# EasyEDA schematic scheme_EasyEDA.json
TITLE: Protogen; REV: 0.2; Date: 2026-06-23; Sheet: 1/2; Company: e7
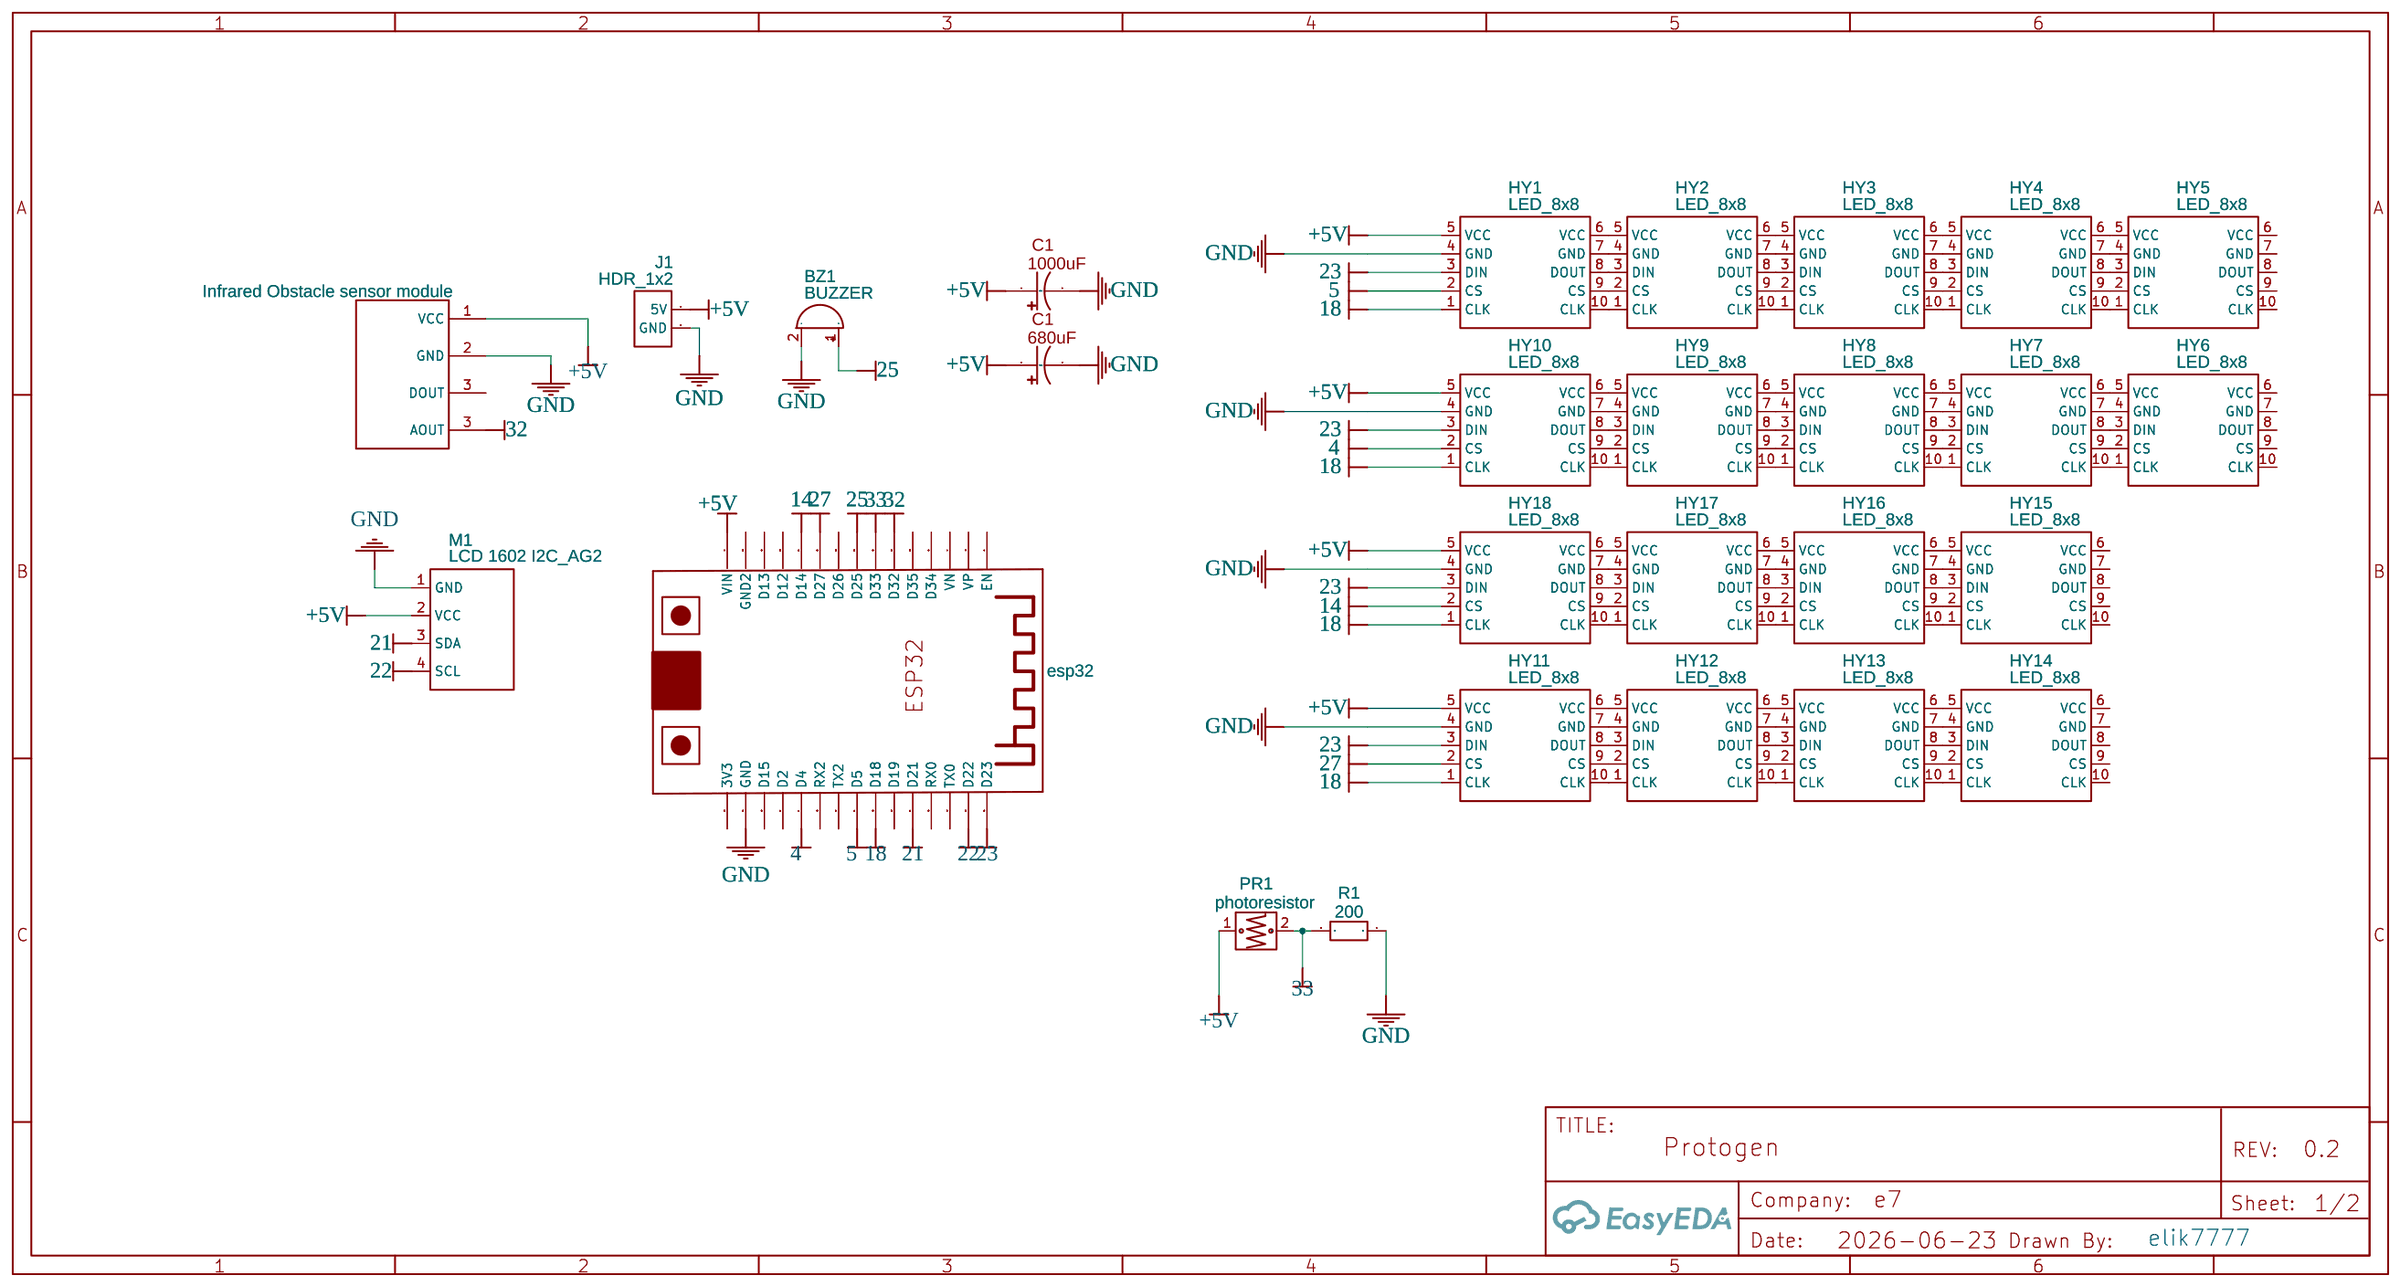
[diagram p0: schematic sheet]

## Parts
1  esp32  [ESP32-DEVKITV1_ESP32-DEVKITV1]
BZ1  BUZZER  [BUZZER_BEEPER:BUZZER_12X9.5RM7.6]
HY1  LED_8x8  [HY_MAX7219_LED_MATRIX]
HY2  LED_8x8  [HY_MAX7219_LED_MATRIX]
HY3  LED_8x8  [HY_MAX7219_LED_MATRIX]
HY4  LED_8x8  [HY_MAX7219_LED_MATRIX]
HY5  LED_8x8  [HY_MAX7219_LED_MATRIX]
HY6  LED_8x8  [HY_MAX7219_LED_MATRIX]
HY7  LED_8x8  [HY_MAX7219_LED_MATRIX]
HY8  LED_8x8  [HY_MAX7219_LED_MATRIX]
HY9  LED_8x8  [HY_MAX7219_LED_MATRIX]
HY10  LED_8x8  [HY_MAX7219_LED_MATRIX]
HY11  LED_8x8  [HY_MAX7219_LED_MATRIX]
HY12  LED_8x8  [HY_MAX7219_LED_MATRIX]
HY13  LED_8x8  [HY_MAX7219_LED_MATRIX]
HY14  LED_8x8  [HY_MAX7219_LED_MATRIX]
HY15  LED_8x8  [HY_MAX7219_LED_MATRIX]
HY16  LED_8x8  [HY_MAX7219_LED_MATRIX]
HY17  LED_8x8  [HY_MAX7219_LED_MATRIX]
HY18  LED_8x8  [HY_MAX7219_LED_MATRIX]
J1  HDR_1x2  [HDR-M-2.54_1X2]
M1  LCD 1602 I2C_AG2  [I2C LCD1602 I2C PCF8574AT]
PR1  photoresistor  [PHOTORESISTOR]
R1  200  [R_AXIAL-0.3]
U1  CAPACITOR  [CAPACITOR, 2.54MM PIN CAPACITOR]
U2  CAPACITOR  [CAPACITOR, 2.54MM PIN CAPACITOR]
U3  Infrared Obstacle sensor module  [INFRARED OBSTACLE SENSOR MODULE]

## Library data of the parts
1 = ESP32-DEVKIT-V1-30PIN: Contributor: fajarrichardo
BZ1 = DEVICE_BUZZER KU: Symbol: Device_Buzzer; Device: Device_Buzzer; Add into BOM: yes; Convert to PCB: yes; Origin Footprint: Buzzer_Beeper:Buzzer_12x9.5RM7.6; Contributor: andreaditiya72
HY1-HY18 = LED_8x8_MAX7219 cm: Manufacturer: Artillery 3C Store; Manufacturer Part: 32305941397 B; Supplier: AliExpress; Supplier Part: 32305941397; link: https://www.aliexpress.com/item/Free-shipping-MAX7219-dot-matrix-module-microcontroller-module-for-arduino-display-module-finished-goods/32305941397.html; Contributor: LieBtrau
J1 = HDR-M-2.54_1x2: Supplier Part: C124375; Supplier: LCSC; Contributor: LCEDA_Lib
M1 = LCD 1602 I2C_AG2: Contributor: pesonacorp
PR1 = photoresistor: Contributor: Christian GILSON
R1 = R_AXIAL-0.3_EU: Contributor: LCEDA_Lib
U1 U2 = CAPACITOR: Contributor: mclaude625
U3 = Infrared Obstacle sensor module: Contributor: Sebastian

## Nets
+5V: 1.VIN HY1.5(VCC) HY10.5(VCC) HY11.5(VCC) HY18.5(VCC) J1.1(5V) M1.2(VCC) PR1.1 U1.1 U2.1 U3.1(VCC)
GND: 1.GND BZ1.2(-) HY1.4(GND) HY10.4(GND) HY11.4(GND) HY18.4(GND) J1.2(GND) M1.1(GND) R1.1 U1.2 U2.2 U3.2(GND)
4: 1.D4 HY10.2(CS)
5: 1.D5 HY1.2(CS)
14: 1.D14 HY18.2(CS)
18: 1.D18 HY1.1(CLK) HY10.1(CLK) HY11.1(CLK) HY18.1(CLK)
21: 1.D21 M1.3(SDA)
22: 1.D22 M1.4(SCL)
23: 1.D23 HY1.3(DIN) HY10.3(DIN) HY11.3(DIN) HY18.3(DIN)
25: 1.D25 BZ1.1(+)
27: 1.D27 HY11.2(CS)
32: 1.D32 U3.3(AOUT)
33: 1.D33 PR1.2 R1.2
Net-(HY1-6): HY1.6(VCC) HY2.5(VCC)
Net-(HY1-7): HY1.7(GND) HY2.4(GND)
Net-(HY1-8): HY1.8(DOUT) HY2.3(DIN)
Net-(HY1-9): HY1.9(CS) HY2.2(CS)
Net-(HY1-10): HY1.10(CLK) HY2.1(CLK)
Net-(HY2-6): HY2.6(VCC) HY3.5(VCC)
Net-(HY2-7): HY2.7(GND) HY3.4(GND)
Net-(HY2-8): HY2.8(DOUT) HY3.3(DIN)
Net-(HY2-9): HY2.9(CS) HY3.2(CS)
Net-(HY2-10): HY2.10(CLK) HY3.1(CLK)
Net-(HY3-6): HY3.6(VCC) HY4.5(VCC)
Net-(HY3-7): HY3.7(GND) HY4.4(GND)
Net-(HY3-8): HY3.8(DOUT) HY4.3(DIN)
Net-(HY3-9): HY3.9(CS) HY4.2(CS)
Net-(HY3-10): HY3.10(CLK) HY4.1(CLK)
Net-(HY4-6): HY4.6(VCC) HY5.5(VCC)
Net-(HY4-7): HY4.7(GND) HY5.4(GND)
Net-(HY4-8): HY4.8(DOUT) HY5.3(DIN)
Net-(HY4-9): HY4.9(CS) HY5.2(CS)
Net-(HY4-10): HY4.10(CLK) HY5.1(CLK)
Net-(HY6-1): HY6.1(CLK) HY7.10(CLK)
Net-(HY6-2): HY6.2(CS) HY7.9(CS)
Net-(HY6-3): HY6.3(DIN) HY7.8(DOUT)
Net-(HY6-4): HY6.4(GND) HY7.7(GND)
Net-(HY6-5): HY6.5(VCC) HY7.6(VCC)
Net-(HY7-1): HY7.1(CLK) HY8.10(CLK)
Net-(HY7-2): HY7.2(CS) HY8.9(CS)
Net-(HY7-3): HY7.3(DIN) HY8.8(DOUT)
Net-(HY7-4): HY7.4(GND) HY8.7(GND)
Net-(HY7-5): HY7.5(VCC) HY8.6(VCC)
Net-(HY8-1): HY8.1(CLK) HY9.10(CLK)
Net-(HY8-2): HY8.2(CS) HY9.9(CS)
Net-(HY8-3): HY8.3(DIN) HY9.8(DOUT)
Net-(HY8-4): HY8.4(GND) HY9.7(GND)
Net-(HY8-5): HY8.5(VCC) HY9.6(VCC)
Net-(HY9-1): HY9.1(CLK) HY10.10(CLK)
Net-(HY9-2): HY9.2(CS) HY10.9(CS)
Net-(HY9-3): HY9.3(DIN) HY10.8(DOUT)
Net-(HY9-4): HY9.4(GND) HY10.7(GND)
Net-(HY9-5): HY9.5(VCC) HY10.6(VCC)
Net-(HY11-6): HY11.6(VCC) HY12.5(VCC)
Net-(HY11-7): HY11.7(GND) HY12.4(GND)
Net-(HY11-8): HY11.8(DOUT) HY12.3(DIN)
Net-(HY11-9): HY11.9(CS) HY12.2(CS)
Net-(HY11-10): HY11.10(CLK) HY12.1(CLK)
Net-(HY12-6): HY12.6(VCC) HY13.5(VCC)
Net-(HY12-7): HY12.7(GND) HY13.4(GND)
Net-(HY12-8): HY12.8(DOUT) HY13.3(DIN)
Net-(HY12-9): HY12.9(CS) HY13.2(CS)
Net-(HY12-10): HY12.10(CLK) HY13.1(CLK)
Net-(HY13-6): HY13.6(VCC) HY14.5(VCC)
Net-(HY13-7): HY13.7(GND) HY14.4(GND)
Net-(HY13-8): HY13.8(DOUT) HY14.3(DIN)
Net-(HY13-9): HY13.9(CS) HY14.2(CS)
Net-(HY13-10): HY13.10(CLK) HY14.1(CLK)
Net-(HY15-1): HY15.1(CLK) HY16.10(CLK)
Net-(HY15-2): HY15.2(CS) HY16.9(CS)
Net-(HY15-3): HY15.3(DIN) HY16.8(DOUT)
Net-(HY15-4): HY15.4(GND) HY16.7(GND)
Net-(HY15-5): HY15.5(VCC) HY16.6(VCC)
Net-(HY16-1): HY16.1(CLK) HY17.10(CLK)
Net-(HY16-2): HY16.2(CS) HY17.9(CS)
Net-(HY16-3): HY16.3(DIN) HY17.8(DOUT)
Net-(HY16-4): HY16.4(GND) HY17.7(GND)
Net-(HY16-5): HY16.5(VCC) HY17.6(VCC)
Net-(HY17-1): HY17.1(CLK) HY18.10(CLK)
Net-(HY17-2): HY17.2(CS) HY18.9(CS)
Net-(HY17-3): HY17.3(DIN) HY18.8(DOUT)
Net-(HY17-4): HY17.4(GND) HY18.7(GND)
Net-(HY17-5): HY17.5(VCC) HY18.6(VCC)

Not connected (* = marked no-connect by the designer): 1 3V3 D2 D12 D13 D15 D19 D26 D34 D35 EN GND2 RX0 RX2 TX0 TX2 VN VP; HY5 6(VCC) 7(GND) 8(DOUT) 9(CS) 10(CLK); HY6 6(VCC) 7(GND) 8(DOUT) 9(CS) 10(CLK); HY14 6(VCC) 7(GND) 8(DOUT) 9(CS) 10(CLK); HY15 6(VCC) 7(GND) 8(DOUT) 9(CS) 10(CLK)

## Notes on the sheet
- elik7777
